# EAGLE design ecu-new (EAGLE 6.4)
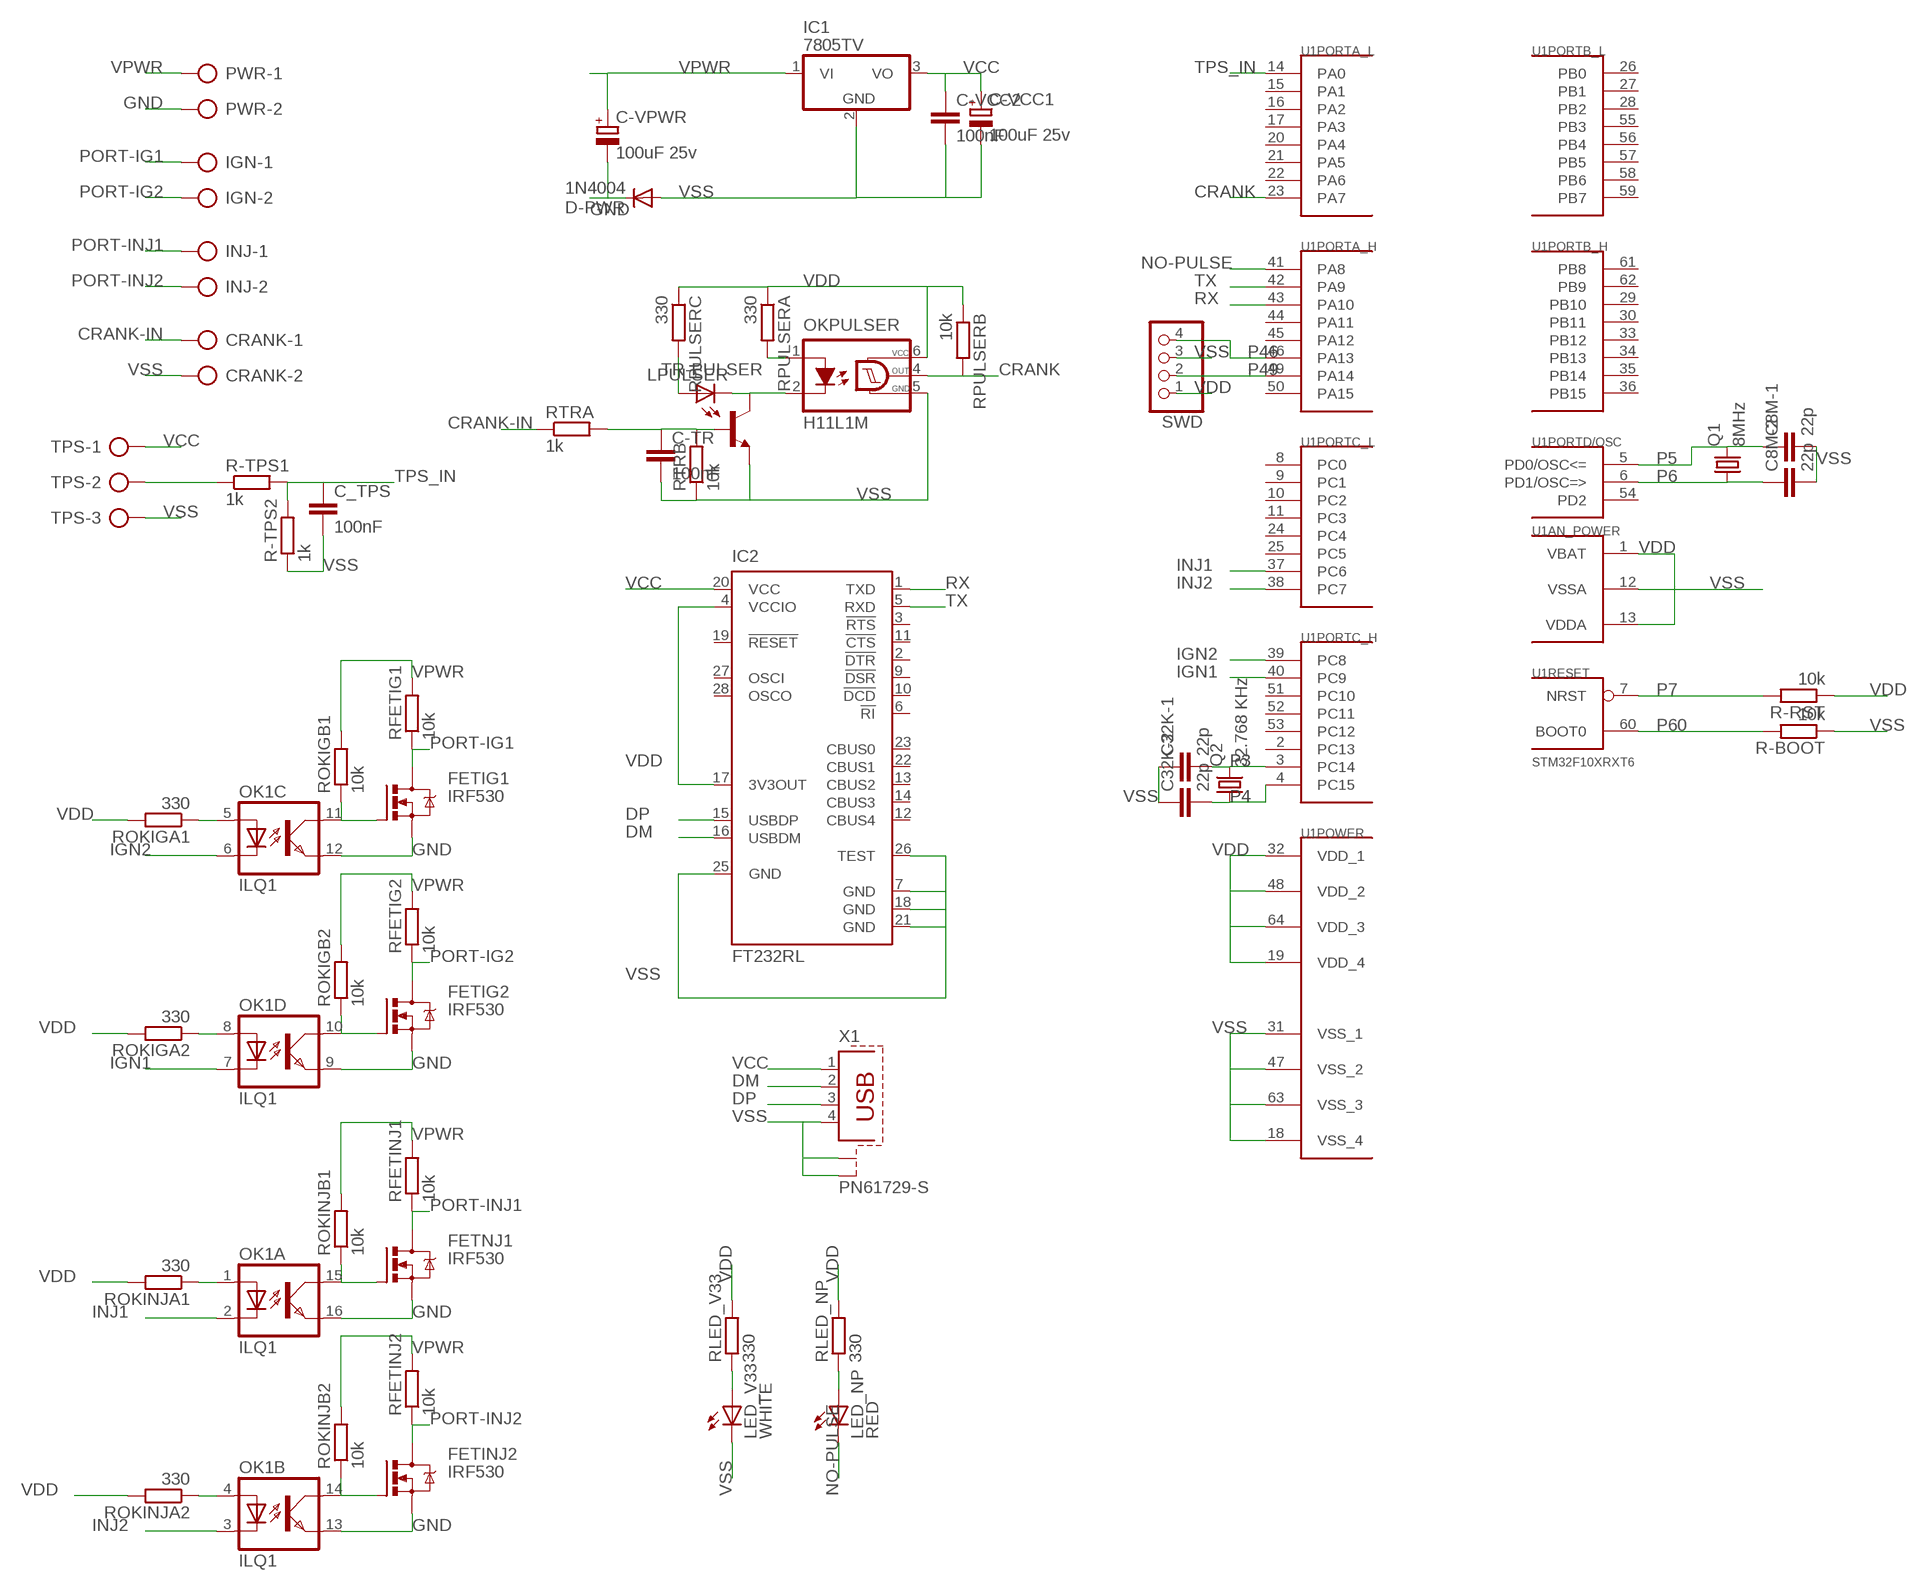
[diagram p0: schematic, sheet 1]

## Parts
C8M-1  22p  C-EU025-030X050  [C025-030X050]
C8M-2  22p  C-EU025-030X050  [C025-030X050]
C32K-1  22p  C-EU025-030X050  [C025-030X050]
C32K-2  22p  C-EU025-030X050  [C025-030X050]
C-TR  100nF  C-EU050-024X044  [C050-024X044]
C-VCC1  100uF 25v  CPOL-EUE2.5-7  [E2,5-7]
C-VCC2  100nF  C-EU050-024X044  [C050-024X044]
C-VPWR  100uF 25v  CPOL-EUE2.5-7  [E2,5-7]
C_TPS  100nF  C-EU050-024X044  [C050-024X044]
CRANK  AK300/2  [AK300/2]
D-PWR  1N4004  [DO41-10]
FETIG1  IRF530  [TO220BV]
FETIG2  IRF530  [TO220BV]
FETINJ2  IRF530  [TO220BV]
FETNJ1  IRF530  [TO220BV]
IC1  7805TV  [TO220V]
IC2  FT232RL  [SSOP28]
IGN  AK300/2  [AK300/2]
INJ  AK300/2  [AK300/2]
LED_NP  RED  LED3MM  [LED3MM]
LED_V33  WHITE  LED3MM  [LED3MM]
LPULSER  LED3MM  [LED3MM]
OK1  ILQ1  [DIL16]
OKPULSER  H11L1M  [DIL06]
PWR  AK300/2  [AK300/2]
Q1  8MHz  CRYSTALHC49S  [HC49/S]
Q2  32.768 KHz  CRYSTALTC26H  [TC26H]
R-BOOT  10k  R-EU_0204/7  [0204/7]
R-RST  10k  R-EU_0204/7  [0204/7]
R-TPS1  1k  R-EU_0204/7  [0204/7]
R-TPS2  1k  R-EU_0204/7  [0204/7]
RFETIG1  10k  R-EU_0204/7  [0204/7]
RFETIG2  10k  R-EU_0204/7  [0204/7]
RFETINJ1  10k  R-EU_0204/7  [0204/7]
RFETINJ2  10k  R-EU_0204/7  [0204/7]
RLED_NP  330  R-EU_0204/7  [0204/7]
RLED_V33  330  R-EU_0204/7  [0204/7]
ROKIGA1  330  R-EU_0204/7  [0204/7]
ROKIGA2  330  R-EU_0204/7  [0204/7]
ROKIGB1  10k  R-EU_0204/7  [0204/7]
ROKIGB2  10k  R-EU_0204/7  [0204/7]
ROKINJA1  330  R-EU_0204/7  [0204/7]
ROKINJA2  330  R-EU_0204/7  [0204/7]
ROKINJB1  10k  R-EU_0204/7  [0204/7]
ROKINJB2  10k  R-EU_0204/7  [0204/7]
RPULSERA  330  R-EU_0204/7  [0204/7]
RPULSERB  10k  R-EU_0204/7  [0204/7]
RPULSERC  330  R-EU_0204/7  [0204/7]
RTRA  1k  R-EU_0204/7  [0204/7]
RTRB  10k  R-EU_0204/7  [0204/7]
SWD  PINHD-1X4  [1X04]
TPS  AK300/3  [AK300/3]
TR-PULSER  2N3904-NPN-TO92-EBC  [TO92-EBC]
U1  STM32F10XRXT6  [TQFP64]
X1  PN61729-S  [PN61729-S]

## Nets
CRANK: OKPULSER.4(OUT) RPULSERB.2 U1.23(PORTA_L:PA7)
CRANK-IN: CRANK.1 RTRA.1
DM: IC2.16(USBDM) X1.2
DP: IC2.15(USBDP) X1.3
GND: C-VPWR.- D-PWR.C FETIG1.S FETIG2.S FETINJ2.S FETNJ1.S OK1.9(D:EMIT) OK1.12(C:EMIT) OK1.13(B:EMIT) OK1.16(A:EMIT) PWR.2
IGN1: OK1.7(D:C) U1.40(PORTC_H:PC9)
IGN2: OK1.6(C:C) U1.39(PORTC_H:PC8)
INJ1: OK1.2(A:C) U1.37(PORTC_L:PC6)
INJ2: OK1.3(B:C) U1.38(PORTC_L:PC7)
N$1: OK1.4(B:A) ROKINJA2.1
N$3: C-TR.1 RTRA.2 RTRB.2 TR-PULSER.B
N$5: OKPULSER.1(A) RPULSERA.2
N$6: LPULSER.A RPULSERC.2
N$7: LPULSER.K(C) OKPULSER.2(C) TR-PULSER.C
N$8: OK1.5(C:A) ROKIGA1.1
N$9: OK1.8(D:A) ROKIGA2.1
N$10: OK1.1(A:A) ROKINJA1.1
N$11: FETIG2.G OK1.10(D:COL) ROKIGB2.1
N$12: FETNJ1.G OK1.15(A:COL) ROKINJB1.1
N$13: FETIG1.G OK1.11(C:COL) ROKIGB1.1
N$14: FETINJ2.G OK1.14(B:COL) ROKINJB2.1
N$18: R-TPS1.1 TPS.2
N$19: LED_V33.A RLED_V33.1
N$25: LED_NP.A RLED_NP.1
NO-PULSE: LED_NP.K(C) U1.41(PORTA_H:PA8)
P3: C32K-1.2 Q2.2 U1.3(PORTC_H:PC14)
P4: C32K-2.2 Q2.1 U1.4(PORTC_H:PC15)
P5: C8M-1.1 Q1.2 U1.5(PORTD/OSC:PD0/OSC<=)
P6: C8M-2.1 Q1.1 U1.6(PORTD/OSC:PD1/OSC=>)
P7: R-RST.2 U1.7(RESET:NRST)
P46: SWD.4 U1.46(PORTA_H:PA13)
P49: SWD.2 U1.49(PORTA_H:PA14)
P60: R-BOOT.2 U1.60(RESET:BOOT0)
PORT-IG1: FETIG1.D IGN.1 RFETIG1.1
PORT-IG2: FETIG2.D IGN.2 RFETIG2.1
PORT-INJ1: FETNJ1.D INJ.1 RFETINJ1.1
PORT-INJ2: FETINJ2.D INJ.2 RFETINJ2.1
RX: IC2.1(TXD) U1.43(PORTA_H:PA10)
TPS_IN: C_TPS.1 R-TPS1.2 R-TPS2.2 U1.14(PORTA_L:PA0)
TX: IC2.5(RXD) U1.42(PORTA_H:PA9)
VCC: C-VCC1.+ C-VCC2.1 IC1.3(VO) IC2.20(VCC) TPS.1 X1.1
VDD: IC2.4(VCCIO) IC2.17(3V3OUT) OKPULSER.6(VCC) R-RST.1 RLED_NP.2 RLED_V33.2 ROKIGA1.2 ROKIGA2.2 ROKINJA1.2 ROKINJA2.2 RPULSERA.1 RPULSERB.1 RPULSERC.1 SWD.1 U1.1(AN_POWER:VBAT) U1.13(AN_POWER:VDDA) U1.19(POWER:VDD_4) U1.32(POWER:VDD_1) U1.48(POWER:VDD_2) U1.64(POWER:VDD_3)
VPWR: C-VPWR.+ IC1.1(VI) PWR.1 RFETIG1.2 RFETIG2.2 RFETINJ1.2 RFETINJ2.2 ROKIGB1.2 ROKIGB2.2 ROKINJB1.2 ROKINJB2.2
VSS: C8M-1.2 C8M-2.2 C32K-1.1 C32K-2.1 C-TR.2 C-VCC1.- C-VCC2.2 C_TPS.2 CRANK.2 D-PWR.A IC1.2(GND) IC2.7(GND) IC2.18(GND) IC2.21(GND) IC2.25(GND) IC2.26(TEST) LED_V33.K(C) OKPULSER.5(GND) R-BOOT.1 R-TPS2.1 RTRB.1 SWD.3 TPS.3 TR-PULSER.E U1.12(AN_POWER:VSSA) U1.18(POWER:VSS_4) U1.31(POWER:VSS_1) U1.47(POWER:VSS_2) U1.63(POWER:VSS_3) X1.4 X1.S1 X1.S2
Unconnected: IC2.2(!DTR) IC2.3(!RTS) IC2.6(!RI) IC2.9(!DSR) IC2.10(!DCD) IC2.11(!CTS) IC2.12(CBUS4) IC2.13(CBUS2) IC2.14(CBUS3) IC2.19(!RESET) IC2.22(CBUS1) IC2.23(CBUS0) IC2.27(OSCI) IC2.28(OSCO) U1.2(PORTC_H:PC13) U1.8(PORTC_L:PC0) U1.9(PORTC_L:PC1) U1.10(PORTC_L:PC2) U1.11(PORTC_L:PC3) U1.15(PORTA_L:PA1) U1.16(PORTA_L:PA2) U1.17(PORTA_L:PA3) U1.20(PORTA_L:PA4) U1.21(PORTA_L:PA5) U1.22(PORTA_L:PA6) U1.24(PORTC_L:PC4) U1.25(PORTC_L:PC5) U1.26(PORTB_L:PB0) U1.27(PORTB_L:PB1) U1.28(PORTB_L:PB2) U1.29(PORTB_H:PB10) U1.30(PORTB_H:PB11) U1.33(PORTB_H:PB12) U1.34(PORTB_H:PB13) U1.35(PORTB_H:PB14) U1.36(PORTB_H:PB15) U1.44(PORTA_H:PA11) U1.45(PORTA_H:PA12) U1.50(PORTA_H:PA15) U1.51(PORTC_H:PC10) U1.52(PORTC_H:PC11) U1.53(PORTC_H:PC12) U1.54(PORTD/OSC:PD2) U1.55(PORTB_L:PB3) U1.56(PORTB_L:PB4) U1.57(PORTB_L:PB5) U1.58(PORTB_L:PB6) U1.59(PORTB_L:PB7) U1.61(PORTB_H:PB8) U1.62(PORTB_H:PB9)

## Library data of the parts
C8M-1 C8M-2 C32K-1 C32K-2 C-TR C-VCC2 C_TPS = resistor:C-EU: CAPACITOR, European symbol
C-VCC1 C-VPWR = resistor:CPOL-EU: POLARIZED CAPACITOR, European symbol
CRANK IGN INJ PWR = con-ptr500:AK300/2: CONNECTOR; OC_FARNELL: unknown; OC_NEWARK: unknown
D-PWR = diode:1N4004: DIODE general purpose rectifier, 1 A
FETIG1 FETIG2 FETINJ2 FETNJ1 = transistor-power:IRF530: HEXFET Power MOSFET
IC1 = linear:78*: Positive VOLTAGE REGULATOR Source: http://cache.national.com/ds/LM/LM78L05.pdf http://www.fairchildsemi.com/ds/LM/LM7805.pdf
IC2 = ftdichip:FT232R: Source: http://www.ftdichip.com/Documents/DataSheets/DS_FT232R_v104.pdf; MPN: FT232RL; OC_FARNELL: 1146032; OC_NEWARK: 91K9918
LED_NP LED_V33 LPULSER = led:LED: LED OSRAM: - CHIPLED LG R971, LG N971, LY N971, LG Q971, LY Q971, LO R971, LY R971 LH N974, LH R974 LS Q976, LO Q976, LY Q976 LO Q996 - Hyper CHIPLED LW Q18S LB Q993, LB Q99A, LB R99A - SideLED LS A670, LO A670, LY A670, LG A670, LP A670 LB A673, LV A673, LT A673, LW A673 LH A674 LY A675 LS A676, LA A676, LO A676, LY A676, LW A676 LS A679, LY A679, LG A679 - Hyper Micro SIDELED® LS Y876, LA Y876, LO Y876, LY Y876 LT Y87S - SmartLED LW L88C, LW L88S LB L89C, LB L89S, LG L890 LS L89K, LO L89K, LY L89K LS L896, LA L896, LO L896, LY L896 - TOPLED LS T670, LO T670, LY T670, LG T670, LP T670 LSG T670, LSP T670, LSY T670, LOP T670, LYG T670 LG T671, LOG T671, LSG T671 LB T673, LV T673, LT T673, LW T673 LH T674 LS T676, LA T676, LO T676, LY T676, LB T676, LH T676, LSB T676, LW T676 LB T67C, LV T67C, LT T67C, LS T67K, LO T67K, LY T67K, LW E67C LS E67B, LA E67B, LO E67B, LY E67B, LB E67C, LV E67C, LT E67C LW T67C LS T679, LY T679, LG T679 LS T770, LO T770, LY T770, LG T770, LP T770 LB T773, LV T773, LT T773, LW T773 LH T774 LS E675, LA E675, LY E675, LS T675 LS T776, LA T776, LO T776, LY T776, LB T776 LHGB T686 LT T68C, LB T68C - Hyper Mini TOPLED® LB M676 - Mini TOPLED Santana® LG M470 LS M47K, LO M47K, LY M47K Source: http://www.osram.convergy.de LUXEON: - LUMILED® LXK2-PW12-R00, LXK2-PW12-S00, LXK2-PW14-U00, LXK2-PW14-V00 LXK2-PM12-R00, LXK2-PM12-S00, LXK2-PM14-U00 LXK2-PE12-Q00, LXK2-PE12-R00, LXK2-PE12-S00, LXK2-PE14-T00, LXK2-PE14-U00 LXK2-PB12-K00, LXK2-PB12-L00, LXK2-PB12-M00, LXK2-PB14-N00, LXK2-PB14-P00, LXK2-PB14-Q00 LXK2-PR12-L00, LXK2-PR12-M00, LXK2-PR14-Q00, LXK2-PR14-R00 LXK2-PD12-Q00, LXK2-PD12-R00, LXK2-PD12-S00 LXK2-PH12-R00, LXK2-PH12-S00 LXK2-PL12-P00, LXK2-PL12-Q00, LXK2-PL12-R00 Source: www.luxeon.com KINGBRIGHT: KA-3528ASYC Source: www.kingbright.com
OK1 = optocoupler:ILQ1: SIEMENS OPTO COUPLER; MF: VISHAY/TELEFUNKEN; MPN: ILQ1; OC_FARNELL: 1469501; OC_NEWARK: 88K1954
OKPULSER = optocoupler:H11L*M: 6-Pin DIP Optocoupler Source: http://www.fairchildsemi.com/ds/H1/H11L2-M.pdf; MF: FAIRCHILD SEMICONDUCTOR; MPN: H11L1-M; OC_FARNELL: 1021127; OC_NEWARK: 72K8643
Q1 = crystal:CRYSTAL: CRYSTAL; OC_FARNELL: 1667008; OC_NEWARK: unknown
Q2 = crystal:CRYSTAL: CRYSTAL; OC_FARNELL: unknown; OC_NEWARK: unknown
R-BOOT R-RST R-TPS1 R-TPS2 RFETIG1 RFETIG2 RFETINJ1 RFETINJ2 RLED_NP RLED_V33 ROKIGA1 ROKIGA2 ROKIGB1 ROKIGB2 ROKINJA1 ROKINJA2 ROKINJB1 ROKINJB2 RPULSERA RPULSERB RPULSERC RTRA RTRB = resistor:R-EU_: RESISTOR, European symbol
SWD = pinhead:PINHD-1X4: PIN HEADER
TPS = con-ptr500:AK300/3: CONNECTOR; OC_FARNELL: unknown; OC_NEWARK: unknown
TR-PULSER = transistor-neu-to92:*-NPN-: NPN Transistror
U1 = stm32:STM32F10XRXT6: STM32F101/103 64pin LQFP
X1 = con-berg:PN61729-S: BERG USB connector; OC_FARNELL: unknown; OC_NEWARK: unknown

## Board
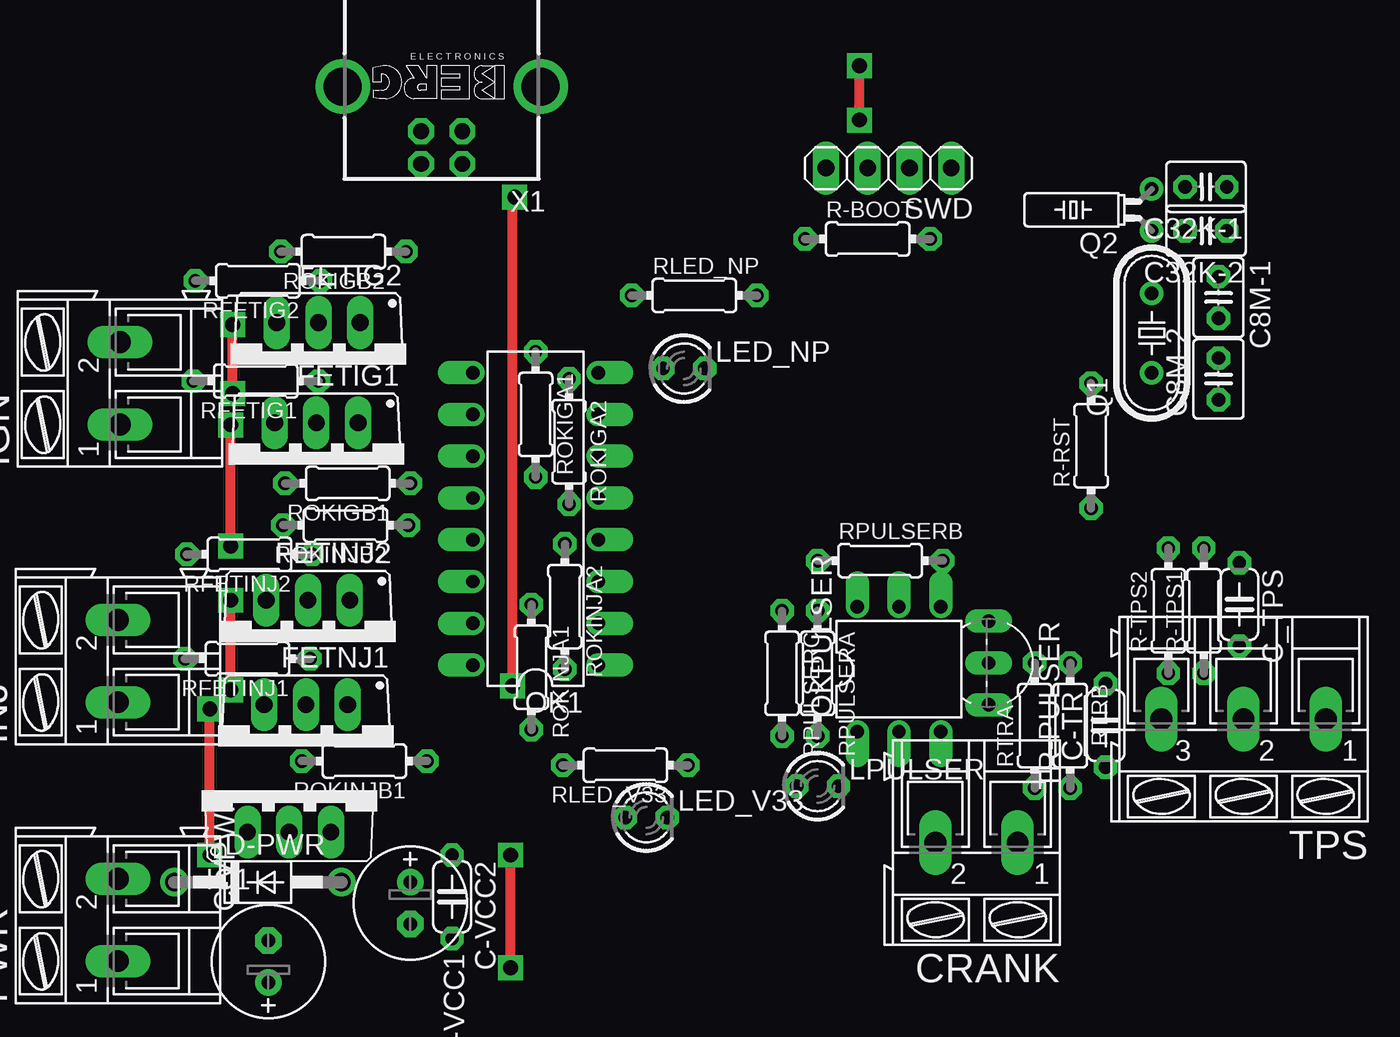
[diagram p1: board, top side]
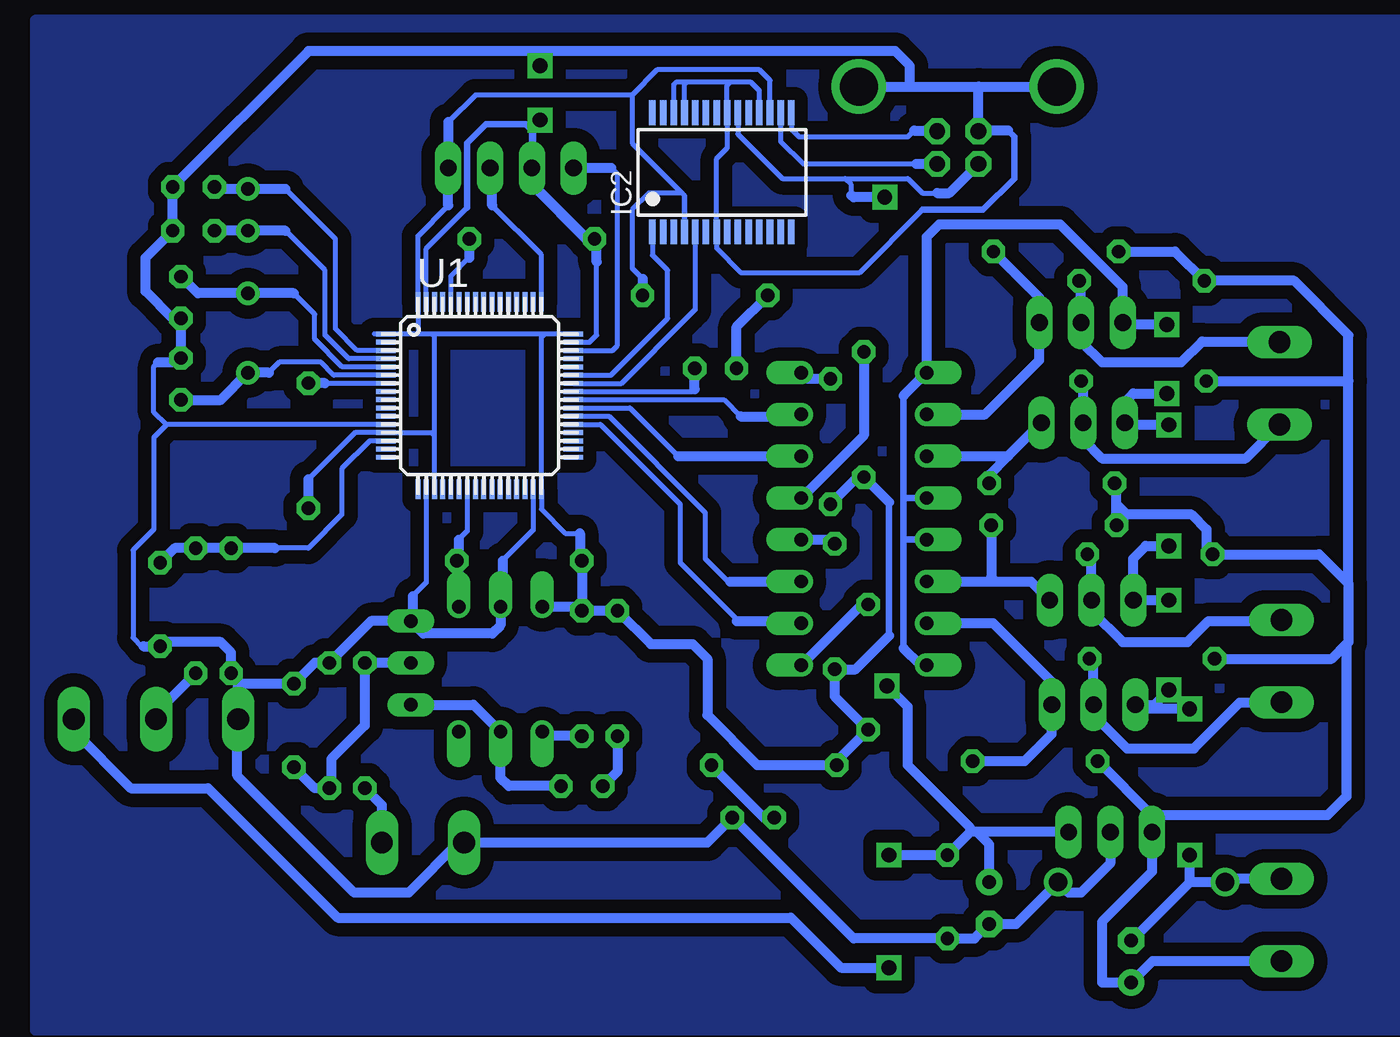
[diagram p2: board, bottom side, seen from below]

No outline drawn. Coordinates in mm, seen from the top.
Copper layers (1*16): Top 0.035mm / dielectric 1.5mm / Bottom 0.035mm
Design rules "default": minimum track width 10mil, minimum drill 24mil, track to track 10mil, track to pad 10mil, pad to pad 10mil, via to via 10mil, smd to smd 10mil, copper to edge 40mil, drill to drill 8mil, minimum pad ring 12mil, minimum via ring 12mil, stop-mask expansion 4mil, vias tented up to drill 0mil, thermal gap 10mil

### Footprints (pad centres in the part's own frame; a part is rotated, then mirrored left to right if it is on the bottom)
C025-030X050 = drill 0.813 octagon: 1 -1.27,0; 2 1.27,0
C050-024X044 = drill 0.813 octagon: 1 -2.54,0; 2 2.54,0
E2,5-7 = drill 0.813 pad 1.6: + -1.27,0 | drill 0.813 pad 1.6 octagon: - 1.27,0
AK300/2 = drill 1.321 long: 1 -2.515,0; 2 2.489,0
DO41-10 = drill 1.118: A 5.08,0; C -5.08,0
TO220BV = drill 1.016 long: D 0,-2.54; G -2.54,-2.54; S 2.54,-2.54
TO220V = drill 1.016 long: 1 -2.54,-2.54; 2 0,-2.54; 3 2.54,-2.54
SSOP28 = smd 0.4 x 1.5: 1 -4.225,-3.625; 2 -3.575,-3.625; 3 -2.925,-3.625; 4 -2.275,-3.625; 5 -1.625,-3.625; 6 -0.975,-3.625; 7 -0.325,-3.625; 8 0.325,-3.625; 9 0.975,-3.625; 10 1.625,-3.625; 11 2.275,-3.625; 12 2.925,-3.625; 13 3.575,-3.625; 14 4.225,-3.625; 15 4.225,3.625; 16 3.575,3.625; 17 2.925,3.625; 18 2.275,3.625; 19 1.625,3.625; 20 0.975,3.625; 21 0.325,3.625; 22 -0.325,3.625; 23 -0.975,3.625; 24 -1.625,3.625; 25 -2.275,3.625; 26 -2.925,3.625; 27 -3.575,3.625; 28 -4.225,3.625
LED3MM = drill 0.813 octagon: A -1.27,0; K 1.27,0
DIL16 = drill 0.813 offset: 1 -8.89,-3.81; 2 -6.35,-3.81; 3 -3.81,-3.81; 4 -1.27,-3.81; 5 1.27,-3.81; 6 3.81,-3.81; 7 6.35,-3.81; 8 8.89,-3.81; 9 8.89,3.81; 10 6.35,3.81; 11 3.81,3.81; 12 1.27,3.81; 13 -1.27,3.81; 14 -3.81,3.81; 15 -6.35,3.81; 16 -8.89,3.81
DIL06 = drill 0.813 offset: 1 -2.54,-3.81; 2 0,-3.81; 3 2.54,-3.81; 4 2.54,3.81; 5 0,3.81; 6 -2.54,3.81
HC49/S = drill 0.813: 1 -2.413,0; 2 2.413,0
TC26H = drill 0.813: 1 -1.27,0; 2 1.27,0
0204/7 = drill 0.813 octagon: 1 -3.81,0; 2 3.81,0
1X04 = drill 1.016 long: 1 -3.81,0; 2 -1.27,0; 3 1.27,0; 4 3.81,0
AK300/3 = drill 1.321 long: 1 -5.004,0; 2 0,0; 3 5.004,0
TO92-EBC = drill 0.813 long: B 0,-1.27; C 2.54,-1.27; E -2.54,-1.27
TQFP64 = smd 1.2 x 0.3: 1 -5.7,3.75; 2 -5.7,3.25; 3 -5.7,2.75; 4 -5.7,2.25; 5 -5.7,1.75; 6 -5.7,1.25; 7 -5.7,0.75; 8 -5.7,0.25; 9 -5.7,-0.25; 10 -5.7,-0.75; 11 -5.7,-1.25; 12 -5.7,-1.75; 13 -5.7,-2.25; 14 -5.7,-2.75; 15 -5.7,-3.25; 16 -5.7,-3.75; 33 5.7,-3.75; 34 5.7,-3.25; 35 5.7,-2.75; 36 5.7,-2.25; 37 5.7,-1.75; 38 5.7,-1.25; 39 5.7,-0.75; 40 5.7,-0.25; 41 5.7,0.25; 42 5.7,0.75; 43 5.7,1.25; 44 5.7,1.75; 45 5.7,2.25; 46 5.7,2.75; 47 5.7,3.25; 48 5.7,3.75 | smd 0.3 x 1.2: 17 -3.75,-5.7; 18 -3.25,-5.7; 19 -2.75,-5.7; 20 -2.25,-5.7; 21 -1.75,-5.7; 22 -1.25,-5.7; 23 -0.75,-5.7; 24 -0.25,-5.7; 25 0.25,-5.7; 26 0.75,-5.7; 27 1.25,-5.7; 28 1.75,-5.7; 29 2.25,-5.7; 30 2.75,-5.7; 31 3.25,-5.7; 32 3.75,-5.7; 49 3.75,5.7; 50 3.25,5.7; 51 2.75,5.7; 52 2.25,5.7; 53 1.75,5.7; 54 1.25,5.7; 55 0.75,5.7; 56 0.25,5.7; 57 -0.25,5.7; 58 -0.75,5.7; 59 -1.25,5.7; 60 -1.75,5.7; 61 -2.25,5.7; 62 -2.75,5.7; 63 -3.25,5.7; 64 -3.75,5.7
PN61729-S = drill 0.95 octagon: 1 1.25,4.71; 2 -1.25,4.71; 3 -1.25,2.71; 4 1.25,2.71 | drill 2.3 pad 2.9: S1 -6.02,0; S2 6.02,0

### Placement (x,y rotation side)
C8M-1  89.79,55.37 270 top
C8M-2  89.79,50.42 90 top
C32K-1  89.03,62.1 180 top
C32K-2  89.03,59.44 180 top
C-TR  82.93,29.34 90 top
C-VCC1  40.64,18.54 270 top
C-VCC2  43.18,18.92 270 top
C-VPWR  32,14.99 90 top
C_TPS  91.06,36.7 270 top
CRANK  75.06,22.23 180 top
D-PWR  31.37,19.81 0 top
FETIG1  34.92,45.21 180 top
FETIG2  35.05,51.31 180 top
FETINJ2  34.42,34.42 180 top
FETNJ1  34.29,28.07 180 top
IC1  33.27,25.4 0 top
IC2  56.9,62.99 0 bottom
IGN  22.99,50.16 90 top
INJ  22.86,33.27 90 top
LED_NP  57.28,51.05 0 top
LED_V33  54.99,23.75 0 top
LPULSER  65.41,25.65 0 top
OK1  48.26,41.91 90 top
OKPULSER  70.36,32.77 0 top
PWR  22.86,17.53 90 top
Q1  85.72,53.21 90 top
Q2  85.72,60.71 90 top
R-BOOT  68.45,58.93 0 top
R-RST  82.04,46.35 90 top
R-TPS1  88.9,36.32 90 top
R-TPS2  86.74,36.32 90 top
RFETIG1  31.24,50.29 180 top
RFETIG2  31.37,56.39 180 top
RFETINJ1  30.73,33.4 180 top
RFETINJ2  30.86,39.75 180 top
RLED_NP  57.91,55.5 0 top
RLED_V33  53.72,26.92 180 top
ROKIGA1  48.26,48.26 270 top
ROKIGA2  50.29,46.61 270 top
ROKIGB1  36.83,44.07 180 top
ROKIGB2  36.58,58.17 180 top
ROKINJA1  48.01,32.89 270 top
ROKINJA2  50.04,36.58 270 top
ROKINJB1  37.85,27.18 180 top
ROKINJB2  36.7,41.53 180 top
RPULSERA  65.41,32.51 270 top
RPULSERB  69.22,39.37 0 top
RPULSERC  63.25,32.51 270 top
RTRA  78.61,29.34 90 top
RTRB  80.77,29.34 270 top
SWD  69.72,63.25 180 top
TPS  91.31,29.72 180 top
TR-PULSER  77.09,33.15 270 top
U1  71.63,49.4 0 bottom
X1  42.55,68.2 180 top

### Tracks (layer width: path | path; a pad name or v marks a point on that pad's centre or on a via)
CRANK
  Bottom 0.305: U1.23 72.38,41.16 72.9,40.64
  Bottom 0.61: 72.9,40.64 72.9,39.5 RPULSERB.2 72.9,39.24 OKPULSER.4
CRANK-IN
  Bottom 0.61: CRANK.1 77.57,24.49 RTRA.1
DM
  Bottom 0.305: IC2.16 53.32,64.88 51.94,63.5 45.09,63.5
  Bottom 0.61: X1.2 45.07,63.49 45.09,63.5
DP
  Bottom 0.305: IC2.15 52.67,65.62 52.2,65.15 45.59,65.15 45.21,65.53
  Bottom 0.61: 45.21,65.53 43.84,65.53 X1.3
GND  (via drill 0.9)
  Top 0.61: v28.45,21.46 v28.45,30.35 | v29.72,31.5 v29.72,36.96 | v29.72,40.26 v29.72,47.62 | v29.84,49.53 v29.84,53.72
  Bottom 0.406: 45.85,34.04 45.85,40.77 | 45.85,40.77 45.85,43.18 | 45.85,43.18 45.85,49.4 | OK1.12 45.85,43.18 | OK1.13 45.72,40.64 45.85,40.77
  Bottom 0.61: OK1.16 44.83,33.02 45.85,34.04 | 45.85,49.4 OK1.9 44.45,59.05 43.69,59.82 36.32,59.82 32.51,56.01 FETIG2.S 32.38,53.72 v29.84,53.72 | PWR.2 26.09,20.02 D-PWR.C 28.45,19.81 | 28.45,19.81 C-VPWR.- | 28.45,19.81 v28.45,21.46 | v28.45,30.35 31.5,30.35 FETNJ1.S 30.61,30.61 v29.72,31.5 | v29.72,36.96 FETINJ2.S 31.88,39.5 31.11,40.26 v29.72,40.26 | v29.72,47.62 32.26,47.62 FETIG1.S 32.38,49.02 31.88,49.53 v29.84,49.53
IGN1
  Bottom 0.305: U1.40 56.77,49.15 55.75,48.13
  Bottom 0.61: 55.75,48.13 52.2,48.13 OK1.7
IGN2
  Bottom 0.305: U1.39 62.5,48.65 59.56,45.72
  Bottom 0.61: 59.56,45.72 OK1.6
INJ1
  Bottom 0.305: U1.37 64.29,47.65 59.44,42.8 59.44,39.24 55.88,35.69 56.01,35.69
  Bottom 0.61: 56.01,35.69 52.2,35.69 OK1.2
INJ2
  Bottom 0.305: U1.38 63.77,48.15 57.91,42.29 57.91,39.5 56.52,38.1 56.39,38.1
  Bottom 0.61: 56.39,38.1 OK1.3
N$1
  Bottom 0.61: OK1.4 50.29,40.64 ROKINJA2.1
N$2
  pour Bottom (isolate 0.813): 15.24,72.26 98.68,72.26 98.68,12.06 98.68,10.79 15.24,10.79
N$3
  Bottom 0.61: TR-PULSER.B RTRA.2 78.61,29.34 80.64,27.3 80.64,25.65 RTRB.2 81.66,25.53 C-TR.1
N$5
  Bottom 0.61: RPULSERA.2 67.56,28.7 OKPULSER.1
N$6
  Bottom 0.61: RPULSERC.2 63.25,26.54 LPULSER.A
N$7
  Bottom 0.61: LPULSER.K 69.85,25.65 70.36,26.16 OKPULSER.2 72.01,30.61 TR-PULSER.C
N$8
  Bottom 0.61: ROKIGA1.1 48.26,46.99 OK1.5
N$9
  Bottom 0.61: ROKIGA2.1 51.69,50.42 OK1.8
N$10
  Bottom 0.61: ROKINJA1.1 48.39,36.7 OK1.1
N$11
  Bottom 0.61: OK1.10 40.89,48.26 37.59,51.56 FETIG2.G 37.59,55.37 ROKIGB2.1
N$12
  Bottom 0.61: OK1.15 40.39,35.56 36.83,32 FETNJ1.G 36.83,28.83 38.48,27.18 ROKINJB1.1
N$13
  Bottom 0.61: OK1.11 39.5,45.72 | 39.5,45.72 FETIG1.G | ROKIGB1.1 40.64,44.58 39.5,45.72
N$14
  Bottom 0.61: OK1.14 40.26,38.1 | 40.26,38.1 38.1,38.1 FETINJ2.G | ROKINJB2.1 40.51,38.35 40.26,38.1
N$18
  Bottom 0.61: TPS.2 91.31,30.1 R-TPS1.1
N$19
  Bottom 0.61: LED_V33.A 54.36,23.75 RLED_V33.1
N$25
  Bottom 0.61: LED_NP.A 56.01,53.59 RLED_NP.1
NO-PULSE
  Bottom 0.305: U1.41 58.68,49.65 58.55,49.78
  Bottom 0.61: 58.55,49.78 LED_NP.K
P3
  Bottom 0.305: U1.3 79.08,52.15 80.39,53.47 80.39,58.93 83.44,61.98
  Bottom 0.61: 83.44,61.98 Q2.2 87.63,61.98 C32K-1.2
P4
  Bottom 0.305: U1.4 79.59,51.65 81.03,53.09 81.03,57.02 83.44,59.44
  Bottom 0.61: 83.44,59.44 Q2.1 C32K-2.2
P5
  Bottom 0.305: U1.5 79.98,51.15 81.66,52.83 81.66,54.36 82.93,55.63
  Bottom 0.61: 82.93,55.63 Q1.2 88.77,55.63 C8M-1.1
P6
  Bottom 0.305: U1.6 80.5,50.65 81.28,51.44 83.82,51.44 84.45,50.8
  Bottom 0.61: 84.45,50.8 Q1.1 87.38,49.15 C8M-2.1
P7
  Bottom 0.305: U1.7 81.01,50.15 81.03,50.16
  Bottom 0.61: 81.03,50.16 R-RST.2
P46
  Bottom 0.305: U1.46 63.54,52.15 63.25,52.45 63.25,62.87 63.63,63.25
  Bottom 0.61: 63.63,63.25 SWD.4
P49
  Bottom 0.305: U1.49 67.88,57.97 70.87,60.96
  Bottom 0.61: 70.87,60.96 70.87,63.12 SWD.2
P60
  Bottom 0.305: U1.60 73.38,56.67 72.26,57.78
  Bottom 0.61: R-BOOT.2 72.26,57.78
PORT-IG1
  Bottom 0.61: RFETIG1.1 34.92,50.16 FETIG1.D 34.92,46.74 33.78,45.59 25.04,45.59 IGN.1
PORT-IG2
  Bottom 0.61: RFETIG2.1 35.05,56.26 FETIG2.D 35.05,52.7 33.78,51.44 28.96,51.44 27.69,52.7 23.04,52.7 IGN.2
PORT-INJ1
  Bottom 0.61: RFETINJ1.1 34.29,33.15 FETNJ1.D 34.29,29.97 32.26,27.94 28.19,27.94 25.4,30.73 22.89,30.73 INJ.1
PORT-INJ2
  Bottom 0.61: RFETINJ2.1 34.42,39.5 FETINJ2.D 34.42,36.32 32.51,34.42 28.57,34.42 27.3,35.69 22.94,35.69 INJ.2
RX
  Bottom 0.305: U1.43 63.65,50.65 60.2,54.1 60.2,57.02 61.12,57.95 IC2.1
TPS_IN
  Bottom 0.305: U1.14 78.31,46.65 80.01,44.96 80.01,42.16 82.04,40.13 84.07,40.13
  Bottom 0.61: 84.07,40.13 R-TPS2.2 R-TPS1.2 90.17,40.13 C_TPS.1
TX
  Bottom 0.305: U1.42 63,50.15 58.86,54.29 58.55,54.61 58.52,54.64 IC2.5
VCC  (via drill 0.9)
  Top 0.61: v46.74,14.61 v46.74,21.46 | v46.86,31.75 46.86,61.34 v46.99,61.47
  Bottom 0.305: IC2.20 55.92,65.32 53.21,62.61 49.4,62.61 | 49.4,62.61 45.59,62.61 44.7,61.72 43.81,61.72 | 49.02,61.59 49.02,62.23 49.4,62.61
  Bottom 0.61: IC1.3 41.4,22.86 | 41.4,22.86 41.78,22.86 | 41.78,22.86 C-VCC2.1 v46.74,21.46 | C-VCC1.+ 40.64,22.1 41.4,22.86 | 43.81,61.72 43.06,61.72 X1.1 | TPS.1 96.32,29.01 92.84,25.53 88.14,25.53 80.26,17.65 52.7,17.65 49.66,14.61 v46.74,14.61 | 41.78,22.86 41.78,23.11 45.59,26.92 45.59,30.48 v46.86,31.75 | v46.99,61.47 48.9,61.47 49.02,61.59
VDD
  Bottom 0.305: 82.04,44.32 79.21,47.15 U1.13 74.54,47.15 74.38,46.99 | 73.53,60.96 75.38,59.12 U1.64 75.38,53.21 75.44,53.15 | IC2.17 53.97,68.58 54.61,69.22 60.83,69.22 62.36,67.69 | 62.36,67.69 62.36,64.77 59.31,61.72 | 59.31,61.72 59.18,61.59 | 59.18,61.59 59.18,59.38 IC2.4 59.17,61.58 59.18,61.59 | 65.53,41.02 66.42,41.02 67.88,42.48 U1.32 67.88,52.97 67.69,53.15 | 67.69,53.15 U1.48 78.05,53.15 | 67.69,53.15 74.55,53.15 | 74.55,53.15 75.44,53.15 | 75.44,53.15 U1.1 | U1.19 74.38,46.99 | 74.38,46.99 74.38,52.98 74.55,53.15 | 62.36,67.69 71.88,67.69 73.53,66.04 | 59.31,61.72 61.34,61.72 62.36,60.71 62.36,57.15 61.72,56.52
  Bottom 0.406: 46.74,42.93 46.74,34.8
  Bottom 0.61: 65.53,41.02 65.53,39.5 RPULSERB.1 RPULSERA.1 | 73.53,60.96 SWD.1 73.53,66.04 | R-RST.1 82.04,44.32 | RPULSERA.1 RPULSERC.1 61.21,34.29 58.67,34.29 57.78,33.4 57.78,29.97 54.74,26.92 RLED_V33.2 49.91,27.18 ROKINJA1.2 50.04,31.11 ROKINJA2.2 48.77,32.77 46.74,34.8 | OKPULSER.6 65.66,36.58 RPULSERA.1 | 61.72,56.52 RLED_NP.2 | ROKIGA2.2 48.64,44.45 ROKIGA1.2 46.74,42.93
VPWR
  Bottom 0.61: PWR.1 30.71,15.01 C-VPWR.+ 33.78,13.72 33.78,17.4 30.73,20.45 IC1.1 30.73,23.88 | ROKIGB2.2 29.34,58.17 RFETIG2.2 22.1,56.39 18.8,53.09 18.8,50.29 | ROKINJB2.2 32.89,42.8 | 32.89,42.8 32.89,43.94 ROKIGB1.2 | 18.8,37.97 18.8,34.42 18.92,34.29 | ROKINJB1.2 30.73,23.88 | RFETINJ1.2 19.81,33.4 18.92,34.29 | 18.92,34.29 18.92,25.02 20.07,23.88 30.73,23.88 | 32.89,42.8 32.26,42.16 28.32,42.16 27.43,41.27 27.43,40.13 RFETINJ2.2 20.57,39.75 18.8,37.97 | 18.8,37.97 18.8,50.29 | RFETIG1.2 18.8,50.29
VSS  (via drill 0.9)
  Top 0.61: v67.94,66.17 v67.94,69.47
  Bottom 0.305: IC2.18 54.62,67.96 55.12,68.45 56.39,68.45 | 56.39,68.45 59.05,68.45 | 59.05,68.45 59.69,68.45 59.82,68.32 IC2.26 | IC2.25 59.17,68.34 59.05,68.45 | 56.39,68.45 56.57,68.27 IC2.21 56.57,64.46 57.22,63.81 IC2.7 57.22,58.36 55.75,56.9 48.51,56.9 44.7,60.71 | 91.19,51.44 91.44,51.18 91.44,48.39 90.71,47.65 U1.12 90.65,47.65 91.44,46.86 91.44,41.27 92.71,40.01 92.71,34.67 92.2,34.16 92.08,34.16 | U1.31 68.38,41.22 70.23,39.37 | U1.18 74.88,38.02 75.69,37.21 | U1.63 74.88,58.34 72.39,60.83 | 68.45,65.53 68.45,62.48 64.9,58.93 | U1.47 64.95,52.65 64.52,53.09 64.52,57.53 | 64.52,58.8 65.15,58.8 68.33,61.98 68.33,65.79 v67.94,66.17
  Bottom 0.406: 72.39,60.83 72.39,64.77 71.25,65.91 68.83,65.91 68.45,65.53 SWD.3 | 44.7,60.71 41.02,60.71 39.12,62.61 39.12,65.15 39.5,65.53
  Bottom 0.61: SWD.3 68.33,63.12 68.33,62.1 65.15,58.93 64.9,58.93 R-BOOT.1 64.52,58.8 64.52,57.53 | TR-PULSER.E 78.23,35.69 RTRB.1 81.66,33.15 C-TR.2 86.11,31.88 R-TPS2.1 | R-TPS2.1 86.31,32.08 TPS.3 86.36,29.67 86.36,26.29 79.25,19.18 75.95,19.18 72.9,22.23 CRANK.2 57.78,22.23 LED_V33.K 48.9,16.38 C-VCC2.2 41.53,16.38 C-VCC1.- 38.99,17.27 D-PWR.A 35.81,19.18 35.05,19.18 33.27,20.95 IC1.2 | R-TPS2.1 86.74,33.78 87.38,34.42 90.81,34.42 C_TPS.2 92.08,34.16 | 91.19,51.44 90.04,51.44 C8M-2.2 C8M-1.2 90.3,54.1 91.95,55.75 91.95,57.78 C32K-2.1 C32K-1.1 82.04,70.36 67.94,70.36 | 70.23,39.37 70.23,36.7 OKPULSER.5 70.36,35.43 70.87,34.92 75.06,34.92 TR-PULSER.E | 75.69,37.21 75.69,35.81 TR-PULSER.E | 41.27,68.2 X1.S1 45.59,68.2 45.47,68.33 45.47,69.47 46.35,70.36 67.94,70.36 | 41.27,68.2 X1.S2 | 41.27,68.2 41.3,68.18 X1.4 41.25,65.53 39.5,65.53 | v67.94,69.47 67.94,70.36